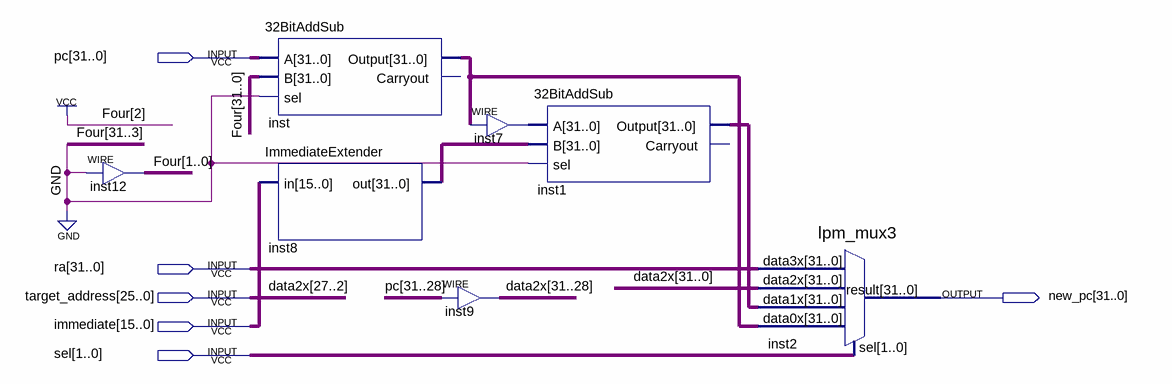
[diagram p0: schematic sheet]
// Quartus schematic PCUpdate.bdf as structural Verilog: 7 symbols, 6 pins
module PCUpdate (
  input  [31:0] pc,
  input  [31:0] ra,
  input  [25:0] target_address,
  input  [15:0] immediate,
  input  [1:0] sel,
  output [31:0] new_pc
);

  wire [31:0] data2x, Four, inst1_output, inst7_out, inst8_out, inst_output;

  assign Four[1:0] = 2'b00;  // WIRE inst12
  \32BitAddSub  inst (.A(pc), .B({Four[31:3], 1'b1, Four[1:0]}), .sel(1'b0), .Output(inst_output));  // open: Carryout
  ImmediateExtender inst8 (.in(immediate), .out(inst8_out));
  assign inst7_out = inst_output;  // WIRE inst7
  assign data2x[31:28] = pc[31:28];  // WIRE inst9
  \32BitAddSub  inst1 (.A(inst7_out), .B(inst8_out), .sel(1'b0), .Output(inst1_output));  // open: Carryout
  lpm_mux3 inst2 (
    .data3x(ra), .data2x({data2x[31:28], target_address, data2x[1:0]}), .data1x(inst1_output),
    .data0x(inst_output), .sel(sel), .result(new_pc));

  // Other names for the same wires on the sheet: data2x[27:2] = target_address
endmodule
